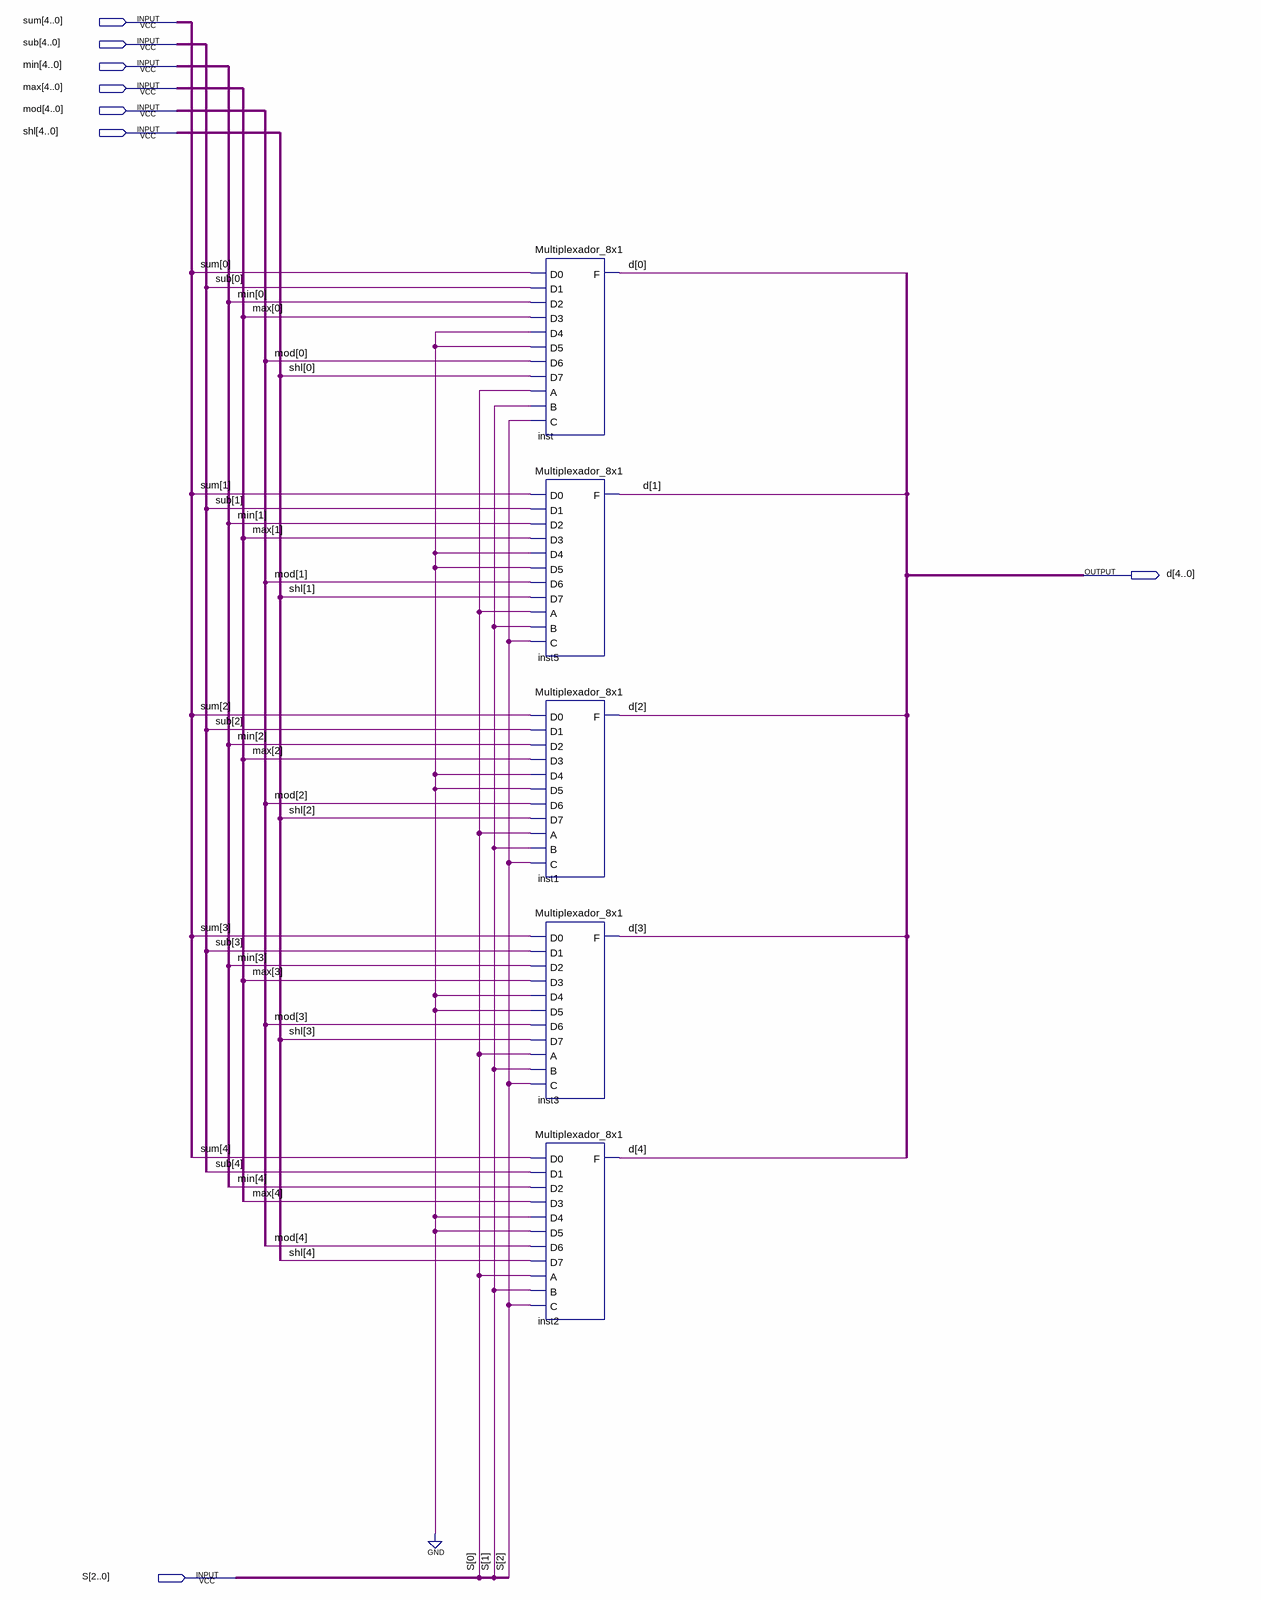
[diagram p0: schematic sheet]
// Quartus schematic BusMux_8x1.bdf as structural Verilog: 5 symbols, 8 pins
module BusMux_8x1 (
  input  [4:0] sum,
  input  [4:0] sub,
  input  [4:0] min,
  input  [4:0] max,
  input  [4:0] mod,
  input  [4:0] shl,
  input  [2:0] S,
  output [4:0] d
);

  Multiplexador_8x1 inst (
    .D0(sum[0]), .D1(sub[0]), .D2(min[0]), .D3(max[0]), .D4(1'b0), .D5(1'b0), .D6(mod[0]), .D7(shl[0]),
    .A(S[0]), .B(S[1]), .C(S[2]), .F(d[0]));
  Multiplexador_8x1 inst5 (
    .D0(sum[1]), .D1(sub[1]), .D2(min[1]), .D3(max[1]), .D4(1'b0), .D5(1'b0), .D6(mod[1]), .D7(shl[1]),
    .A(S[0]), .B(S[1]), .C(S[2]), .F(d[1]));
  Multiplexador_8x1 inst1 (
    .D0(sum[2]), .D1(sub[2]), .D2(min[2]), .D3(max[2]), .D4(1'b0), .D5(1'b0), .D6(mod[2]), .D7(shl[2]),
    .A(S[0]), .B(S[1]), .C(S[2]), .F(d[2]));
  Multiplexador_8x1 inst3 (
    .D0(sum[3]), .D1(sub[3]), .D2(min[3]), .D3(max[3]), .D4(1'b0), .D5(1'b0), .D6(mod[3]), .D7(shl[3]),
    .A(S[0]), .B(S[1]), .C(S[2]), .F(d[3]));
  Multiplexador_8x1 inst2 (
    .D0(sum[4]), .D1(sub[4]), .D2(min[4]), .D3(max[4]), .D4(1'b0), .D5(1'b0), .D6(mod[4]), .D7(shl[4]),
    .A(S[0]), .B(S[1]), .C(S[2]), .F(d[4]));
endmodule
